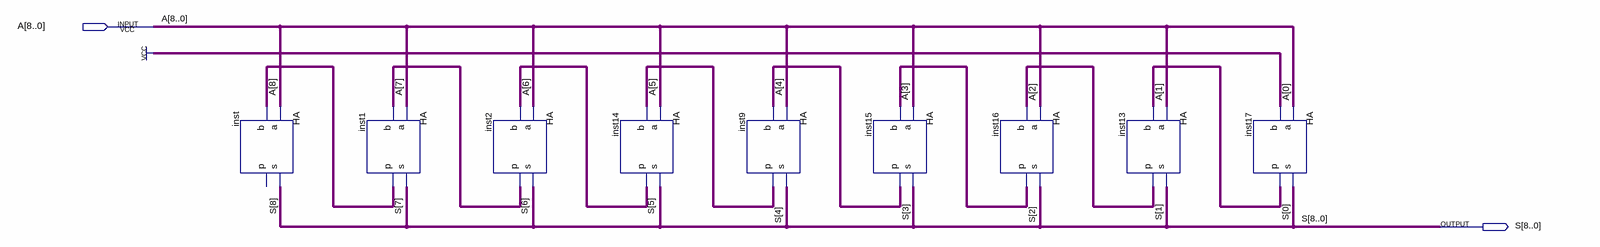
[diagram p0: schematic sheet]
// Quartus schematic add_bit9.bdf as structural Verilog: 9 symbols, 2 pins
module add_bit9 (
  input  [8:0] A,
  output [8:0] S
);

  wire inst1_p, inst2_p, inst9_p, inst13_p, inst14_p, inst15_p, inst16_p, inst17_p;

  HA inst (.a(A[8]), .b(inst1_p), .s(S[8]));  // open: p
  HA inst1 (.a(A[7]), .b(inst2_p), .s(S[7]), .p(inst1_p));
  HA inst2 (.a(A[6]), .b(inst14_p), .s(S[6]), .p(inst2_p));
  HA inst14 (.a(A[5]), .b(inst9_p), .s(S[5]), .p(inst14_p));
  HA inst9 (.a(A[4]), .b(inst15_p), .s(S[4]), .p(inst9_p));
  HA inst15 (.a(A[3]), .b(inst16_p), .s(S[3]), .p(inst15_p));
  HA inst16 (.a(A[2]), .b(inst13_p), .s(S[2]), .p(inst16_p));
  HA inst13 (.a(A[1]), .b(inst17_p), .s(S[1]), .p(inst13_p));
  HA inst17 (.a(A[0]), .b(1'b1), .s(S[0]), .p(inst17_p));
endmodule
